# Altium schematic sheet MCU.SchDoc: Multiplekser interfejsu SWD
size A4; Organization: Altium Limited; Address1: L3, 12a Rodborough Rd; Adress2: Frenchs Forest; Address3: NSW; Address4: Australia 2086; SheetNumber: 2
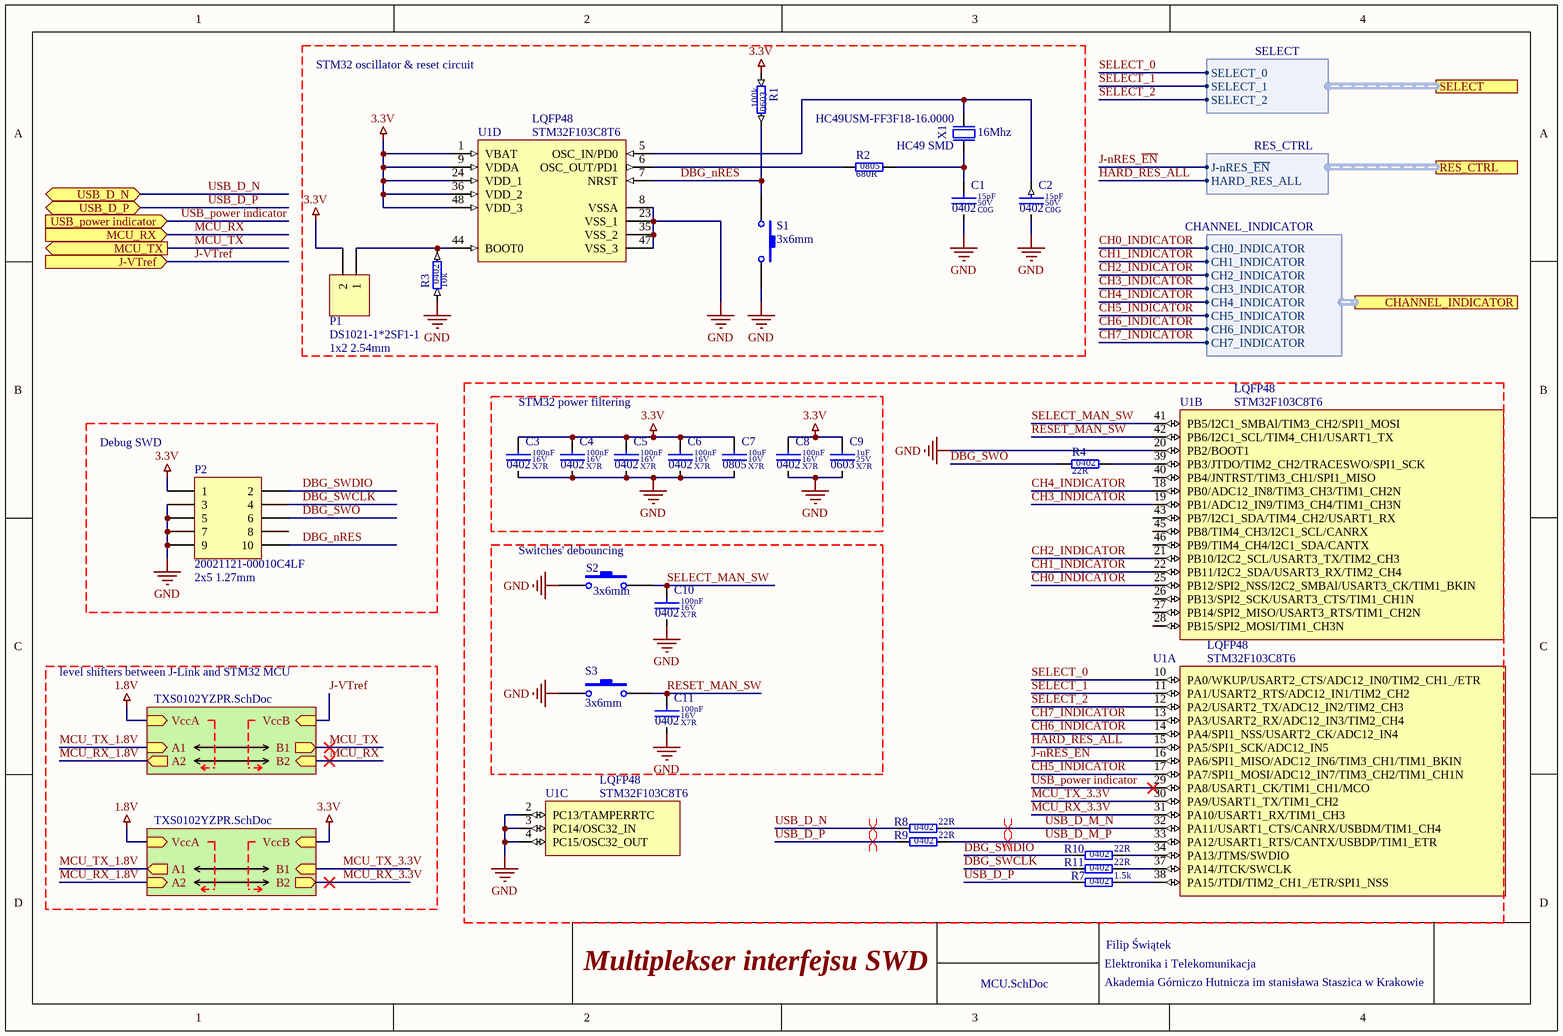
[diagram p0: MCU.SchDoc]

## Parts
C1  value 15pF  Dielectric: C0G  Voltage: 50V  SCH_Footprint: 0402  [C_0402_1005]  (hidden comment: Ceramic C0G)
C2  value 15pF  Dielectric: C0G  Voltage: 50V  SCH_Footprint: 0402  [C_0402_1005]  (hidden comment: Ceramic C0G)
C3  value 100nF  Dielectric: X7R  Voltage: 16V  SCH_Footprint: 0402  [C_0402_1005]  (hidden comment: Ceramic X7R)
C4  value 100nF  Dielectric: X7R  Voltage: 16V  SCH_Footprint: 0402  [C_0402_1005]  (hidden comment: Ceramic X7R)
C5  value 100nF  Dielectric: X7R  Voltage: 16V  SCH_Footprint: 0402  [C_0402_1005]  (hidden comment: Ceramic X7R)
C6  value 100nF  Dielectric: X7R  Voltage: 16V  SCH_Footprint: 0402  [C_0402_1005]  (hidden comment: Ceramic X7R)
C7  value 10uF  Dielectric: X7R  Voltage: 10V  SCH_Footprint: 0805  [C_0805_2012]  (hidden comment: Ceramic X7R)
C8  value 100nF  Dielectric: X7R  Voltage: 16V  SCH_Footprint: 0402  [C_0402_1005]  (hidden comment: Ceramic X7R)
C9  value 1uF  Dielectric: X7R  Voltage: 25V  SCH_Footprint: 0603  [C_0603_1608]  (hidden comment: Ceramic X7R)
C10  value 100nF  Dielectric: X7R  Voltage: 16V  SCH_Footprint: 0402  [C_0402_1005]  (hidden comment: Ceramic X7R)
C11  value 100nF  Dielectric: X7R  Voltage: 16V  SCH_Footprint: 0402  [C_0402_1005]  (hidden comment: Ceramic X7R)
P1  value DS1021-1*2SF1-1  SCH_Footprint: 1x2 2.54mm  [P_HEADER_1x2_2.54]  (hidden comment: Goldpin)
P2  value 20021121-00010C4LF  SCH_Footprint: 2x5 1.27mm  [P_HEADER_2x5_1.27]  (hidden comment: Jtag)
R1  value 100k  SCH_Footprint: 0603  [R_0603_1608]  (hidden comment: Resistor)
R2  value 680R  SCH_Footprint: 0805  [R_0805_2012]  (hidden comment: Resistor)
R3  value 10k  SCH_Footprint: 0402  [R_0402_1005]  (hidden comment: Resistor)
R4  value 22R  SCH_Footprint: 0402  [R_0402_1005]  (hidden comment: Resistor)
R7  value 1.5k  SCH_Footprint: 0402  [R_NC_0402_1005]  (hidden comment: Resistor)
R8  value 22R  SCH_Footprint: 0402  [R_0402_1005]  (hidden comment: Resistor)
R9  value 22R  SCH_Footprint: 0402  [R_0402_1005]  (hidden comment: Resistor)
R10  value 22R  SCH_Footprint: 0402  [R_0402_1005]  (hidden comment: Resistor)
R11  value 22R  SCH_Footprint: 0402  [R_0402_1005]  (hidden comment: Resistor)
S1  3x6mm  [S_TACTSWITCH3x6]
S2  3x6mm  [S_TACTSWITCH3x6]
S3  3x6mm  [S_TACTSWITCH3x6]
U1  SCH_Footprint: LQFP48  [LQFP48_7x7]  (hidden comment: STM32F103C8T6)  (parts A,B,C,D of 4)
X1  value 16Mhz  Manufacturer Part Number: HC49USM-FF3F18-16.0000  SCH_Footprint: HC49 SMD  [X_HC49_SMD]  (hidden comment: *)

## Blocks framed on the sheet
STM32 oscillator & reset circuit: C1 C2 P1 R1-R3 S1 U1 X1
STM32 power filtering: C3-C9
Debug SWD: P2
Switches' debouncing: C10 C11 S2 S3

## Sub-sheets
U_TXS0102YZPR = TXS0102YZPR.SchDoc: A1 (in), A2 (out), B1 (out), B2 (in), VccB (in), VccA (in)
U_TXS0102YZPR = TXS0102YZPR.SchDoc: A1 (out), A2 (in), B1 (in), B2 (out), VccB (in), VccA (in)

## Ports
CHANNEL_INDICATOR (harness CHANNEL_INDICATOR), J-VTref (in), MCU_RX (in), MCU_TX (out), RES_CTRL (harness RES_CTRL), SELECT (harness SELECT), USB_D_N (bidir), USB_D_P (bidir), USB_power indicator (in)

## Harnesses
SELECT: SELECT_0, SELECT_1, SELECT_2
RES_CTRL: HARD_RES_ALL, J-nRES_~{EN}
CHANNEL_INDICATOR: CH1_INDICATOR, CH2_INDICATOR, CH3_INDICATOR, CH4_INDICATOR, CH5_INDICATOR, CH6_INDICATOR, CH7_INDICATOR, CH0_INDICATOR

## Nets
1.8V: sheet U_TXS0102YZPR/VccA, sheet U_TXS0102YZPR/VccA
3.3V: C3.1 C4.1 C5.1 C6.1 C7.1 C8.1 C9.1 P1.2 P2.1 R1.1 U1.1(VBAT) U1.9(VDDA) U1.24(VDD_1) U1.36(VDD_2) U1.48(VDD_3) ; sheet U_TXS0102YZPR/VccB
GND: C1.2 C2.2 C3.2 C4.2 C5.2 C6.2 C7.2 C8.2 C9.2 C10.2 C11.2 P2.3 P2.5 P2.7 P2.9 R3.1 S1.2 S2.1 S3.1 U1.2(PC13/TAMPERRTC) U1.3(PC14/OSC32_IN) U1.4(PC15/OSC32_OUT) U1.8(VSSA) U1.20(PB2/BOOT1) U1.23(VSS_1) U1.35(VSS_2) U1.47(VSS_3)
CH0_INDICATOR: U1.25(PB12/SPI2_NSS/I2C2_SMBAl/USART3_CK/TIM1_BKIN) ; port CHANNEL_INDICATOR.CH0_INDICATOR
CH1_INDICATOR: U1.22(PB11/I2C2_SDA/USART3_RX/TIM2_CH4) ; port CHANNEL_INDICATOR.CH1_INDICATOR
CH2_INDICATOR: U1.21(PB10/I2C2_SCL/USART3_TX/TIM2_CH3) ; port CHANNEL_INDICATOR.CH2_INDICATOR
CH3_INDICATOR: U1.19(PB1/ADC12_IN9/TIM3_CH4/TIM1_CH3N) ; port CHANNEL_INDICATOR.CH3_INDICATOR
CH4_INDICATOR: U1.18(PB0/ADC12_IN8/TIM3_CH3/TIM1_CH2N) ; port CHANNEL_INDICATOR.CH4_INDICATOR
CH5_INDICATOR: U1.17(PA7/SPI1_MOSI/ADC12_IN7/TIM3_CH2/TIM1_CH1N) ; port CHANNEL_INDICATOR.CH5_INDICATOR
CH6_INDICATOR: U1.14(PA4/SPI1_NSS/USART2_CK/ADC12_IN4) ; port CHANNEL_INDICATOR.CH6_INDICATOR
CH7_INDICATOR: U1.13(PA3/USART2_RX/ADC12_IN3/TIM2_CH4) ; port CHANNEL_INDICATOR.CH7_INDICATOR
DBG_nRES: P2.10 R1.2 S1.1 U1.7(NRST)
DBG_SWCLK: P2.4 R11.1
DBG_SWDIO: P2.2 R10.1
DBG_SWO: P2.6 R4.1
HARD_RES_ALL: U1.15(PA5/SPI1_SCK/ADC12_IN5) ; port RES_CTRL.HARD_RES_ALL
J-nRES_~{EN}: U1.16(PA6/SPI1_MISO/ADC12_IN6/TIM3_CH1/TIM1_BKIN) ; port RES_CTRL.J-nRES_~{EN}
J-VTref: port J-VTref, sheet U_TXS0102YZPR/VccB
MCU_RX: port MCU_RX, sheet U_TXS0102YZPR/B2
MCU_RX_1.8V: sheet U_TXS0102YZPR/A2, sheet U_TXS0102YZPR/A2
MCU_RX_3.3V: U1.31(PA10/USART1_RX/TIM1_CH3) ; sheet U_TXS0102YZPR/B2
MCU_TX: port MCU_TX, sheet U_TXS0102YZPR/B1
MCU_TX_1.8V: sheet U_TXS0102YZPR/A1, sheet U_TXS0102YZPR/A1
MCU_TX_3.3V: U1.30(PA9/USART1_TX/TIM1_CH2) ; sheet U_TXS0102YZPR/B1
RESET_MAN_SW: C11.1 S3.2 U1.42(PB6/I2C1_SCL/TIM4_CH1/USART1_TX)
SELECT_0: U1.10(PA0/WKUP/USART2_CTS/ADC12_IN0/TIM2_CH1_/ETR) ; port SELECT.SELECT_0
SELECT_1: U1.11(PA1/USART2_RTS/ADC12_IN1/TIM2_CH2) ; port SELECT.SELECT_1
SELECT_2: U1.12(PA2/USART2_TX/ADC12_IN2/TIM2_CH3) ; port SELECT.SELECT_2
SELECT_MAN_SW: C10.1 S2.2 U1.41(PB5/I2C1_SMBAl/TIM3_CH2/SPI1_MOSI)
USB_D_M_N: R8.2 U1.32(PA11/USART1_CTS/CANRX/USBDM/TIM1_CH4)
USB_D_M_P: R9.2 U1.33(PA12/USART1_RTS/CANTX/USBDP/TIM1_ETR)
USB_D_N: R8.1 ; port USB_D_N
USB_D_P: R7.1 R9.1 ; port USB_D_P
USB_power indicator: U1.29(PA8/USART1_CK/TIM1_CH1/MCO) ; port USB_power indicator
NetC1_1: C1.1 R2.2 X1.1
NetC2_1: C2.1 U1.5(OSC_IN/PD0) X1.2
NetP1_1: P1.1 R3.2 U1.44(BOOT0)
NetR2_1: R2.1 U1.6(OSC_OUT/PD1)
NetR4_2: R4.2 U1.39(PB3/JTDO/TIM2_CH2/TRACESWO/SPI1_SCK)
NetR7_2: R7.2 U1.38(PA15/JTDI/TIM2_CH1_/ETR/SPI1_NSS)
NetR10_2: R10.2 U1.34(PA13/JTMS/SWDIO)
NetR11_2: R11.2 U1.37(PA14/JTCK/SWCLK)

Not connected (* = marked no-connect by the designer): P2 8; U1 26(PB13/SPI2_SCK/USART3_CTS/TIM1_CH1N) 27(PB14/SPI2_MISO/USART3_RTS/TIM1_CH2N) 28(PB15/SPI2_MOSI/TIM1_CH3N) 40(PB4/JNTRST/TIM3_CH1/SPI1_MISO) 43(PB7/I2C1_SDA/TIM4_CH2/USART1_RX) 45(PB8/TIM4_CH3/I2C1_SCL/CANRX) 46(PB9/TIM4_CH4/I2C1_SDA/CANTX)

## Layout directives
differential pair: USB_D_M_N, USB_D_M_P, USB_D_N, USB_D_P

## Notes on the sheet
- level shifters between J-Link and STM32 MCU
- Elektronika i Telekomunikacja
- Akademia Górniczo Hutnicza im stanisława Staszica w Krakowie
- Filip Świątek

## Library data of the parts
C1 C2 = C_15pF_50V_C0G_0402_5: Capacitor; Manufacturer: Murata; Manufacturer Part Number: GRM1555C1H150JA01D; Tolerance (%): 5; Part Number: C_15pF_50V_C0G_0402_5; HelpURL: http://www.tme.eu/en/Document/e3e731e59cc68b1ab6d46b158bb05733/MURATA_GRM.pdf; Supplier 1: TME; Supplier Part Number 1: GRM1555C1H150JA01D; Supplier 2: RS Components; Supplier Part Number 2: 7902758; Supplier 3: Farnell; Supplier Part Number 3: 2218840; Supplier 4: Mouser; Supplier Part Number 4: 81-GRM1555C1H150JA1D; Supplier 5: Digi-Key; Supplier Part Number 5: 490-5888-1-ND
C3-C6 C8 C10 C11 = C_100nF_16V_X7R_0402_10: Capacitor; Manufacturer: Murata; Manufacturer Part Number: GRM155R71C104KA88D; Tolerance (%): 10; Part Number: C_100nF_16V_X7R_0402_10; HelpURL: https://www.mouser.com/ds/2/281/c02e-2905.pdf; Supplier 1: TME; Supplier 2: RS Components; Supplier 3: Farnell; Supplier 4: Mouser; Supplier Part Number 4: 81-GRM155R71C104KA88; Supplier 5: Digi-Key
C7 = C_10uF_10V_X7R_0805_10: Capacitor; Manufacturer: Samsung Electro-Mechanics; Manufacturer Part Number: CL21B106KPQNNNG; Tolerance (%): 10; Part Number: C_10uF_10V_X7R_0805_10; HelpURL: http://www.tme.eu/pl/Document/4a42202b32dab16128fe107dd69598cc/samsung-chip-cap.pdf; Supplier 1: TME; Supplier Part Number 1: CL21B106KPQNNNG; Supplier 2: RS Components; Supplier 3: Farnell; Supplier 4: Mouser; Supplier 5: Digi-Key
C9 = C_1uF_25V_X7R_0603_10: Capacitor; Manufacturer: Samsung; Manufacturer Part Number: CL10B105KA8NNNC; Tolerance (%): 10; Part Number: C_1uF_25V_X7R_0603_10; HelpURL: http://www.tme.eu/pl/Document/4a42202b32dab16128fe107dd69598cc/samsung-chip-cap.pdf; Supplier 1: TME; Supplier Part Number 1: CL10B105KA8NNNC; Supplier 2: RS Components; Supplier 3: Farnell; Supplier 4: Mouser; Supplier 5: Digi-Key
P1 = P_HEADER_1x2_2.54: Header, 2-Pin; Manufacturer: Connfly; Part Number: P_HEADER_1x2_2.54; Component Type: Standard; HelpURL: http://www.tme.eu/en/Document/cc301e58a5da78cb543a94b5a5b7f06a/DS1021.pdf; Manufacturer Part Number: DS1021-1*2SF1-1; Supplier 1: TME; Supplier Part Number 1: ZL201-02G; Supplier 2: RS Components; Supplier 3: Farnell; Supplier 4: Mouser; Supplier 5: Digi-Key
P2 = P_HEADER_2x5_1.27: Header, 10-Pin, Dual row; Manufacturer: FCI; Part Number: P_HEADER_2x5_1.27; Component Type: Standard; HelpURL: http://www.mouser.com/catalog/645/usd/1591.pdf; Manufacturer Part Number: 20021121-00010C4LF; Supplier 1: TME; Supplier Part Number 1: 20021121-00010C4LF; Supplier 2: RS Components; Supplier Part Number 2: 794-4584; Supplier 3: Farnell; Supplier Part Number 3: 1865279; Supplier 4: Mouser; Supplier Part Number 4: 649-202112100010C4LF; Supplier 5: Digi-Key; Supplier Part Number 5: 609-3695-1-ND
R1 = R_100k_0603_1: Manufacturer: Royalohm; Manufacturer Part Number: 0603SAF1003T5E; Voltage: 50V; Power: 100mW; Tolerance: 1%; Part Number: R_100k_0603_1; HelpURL: http://www.tme.eu/pl/Document/b315665a56acbc42df513c99b390ad98/ROYALOHM-THICKFILM.pdf; Supplier 1: TME; Supplier Part Number 1: SMD0603-100K-1%; Supplier 2: RS Components; Supplier 3: Farnell; Supplier 4: Mouser; Supplier Part Number 4: 667-ERJ-3EKF1003V; Supplier 5: Digi-Key; Supplier Part Number 5: P100KHCT-ND
R2 = R_680R_0805_1: Manufacturer: Royalohm; Manufacturer Part Number: HP05W3F6800T5E; Voltage: 150V; Power: 300mW; Tolerance: 1%; Part Number: R_680R_0805_1; HelpURL: https://www.tme.eu/pl/Document/fa390a0a31e891a154d3713216995c6e/HighPowerHP.pdf; Supplier 1: TME; Supplier Part Number 1: HP05-680R1%; Supplier 2: RS Components; Supplier 3: Farnell; Supplier 4: Mouser; Supplier 5: Digi-Key
R3 = R_10k_0402_1: Manufacturer: Yageo; Manufacturer Part Number: RC0402FR-0710KL; Voltage: 50V; Power: 63mW; Tolerance: 1%; Part Number: R_10k_0402_1; HelpURL: http://www.tme.eu/pl/Document/1a2bc76e2be68b3b1670068306778ce6/rc0402yageo.pdf; Supplier 1: TME; Supplier Part Number 1: RC0402FR-0710K; Supplier 2: RS Components; Supplier 3: Farnell; Supplier 4: Mouser; Supplier 5: Digi-Key
R4 R8-R11 = R_22R_0402_1: Manufacturer: Panasonic; Manufacturer Part Number: ERJ-2RKF22R0X; Voltage: 50V; Power: 63mW; Tolerance: 1%; Part Number: R_22R_0402_1; HelpURL: http://datasheet.octopart.com/ERJ2RKF22R0X-Panasonic-datasheet-13266541.pdf; Supplier 1: TME; Supplier 2: RS Components; Supplier Part Number 2: 7325390; Supplier 3: Farnell; Supplier Part Number 3: 2302453; Supplier 4: Mouser; Supplier Part Number 4: 667-ERJ-2RKF22R0X; Supplier 5: Digi-Key; Supplier Part Number 5: P22.0LCT-ND
R7 = R_GENERIC_0402: Part Number: R_GENERIC_0402; Supplier 1: TME; Supplier 2: RS Components; Supplier 3: Farnell; Supplier 4: Mouser; Supplier 5: Digi-Key
S1-S3 = S_TACTSWITCH: Tact Switch; Manufacturer: Ninigi; Manufacturer Part Number: TACTM-34N-F; Part Number: S_TACTSWITCH; SCH_Footprint: 3x6mm; HelpURL: http://pl.ninigi.com/product/tactm-34n-f/pdf; Supplier 1: TME; Supplier Part Number 1: TACTM-34N-F; Supplier 2: RS Components; Supplier 3: Farnell; Supplier 4: Mouser; Supplier 5: Digi-Key
U1 = UP_STM32F103C8T6: Manufacturer: STMicroelectronics; Value: STM32F103C8T6; Part Number: UP_STM32F103C8T6; HelpURL: https://datasheet.octopart.com/STM32F103C8T6-STMicroelectronics-datasheet-48026265.pdf; Manufacturer Part Number: STM32F103C8T6; Supplier 1: TME; Supplier Part Number 1: STM32F103C8T6; Supplier 2: RS Components; Supplier Part Number 2: 1023545; Supplier 3: Farnell; Supplier Part Number 3: 1447637; Supplier 4: Mouser; Supplier Part Number 4: 511-STM32F103C8T6; Supplier 5: Digi-Key; Supplier Part Number 5: 497-6063-ND
X1 = X_HC49USM-FF3F16.00: Resonator Ceramic; Manufacturer: Ilsi; Part Number: X_HC49USM-FF3F16.00; HelpURL: http://www.tme.eu/pl/Document/f9d1782f27c3a96ae8c4e91c94d19ebc/HC49USM_Series.pdf; Supplier 1: TME; Supplier Part Number 1: HC49USM-FF3F16.00; Supplier 2: RS Components; Supplier 3: Farnell; Supplier 4: Mouser; Supplier 5: Digi-Key